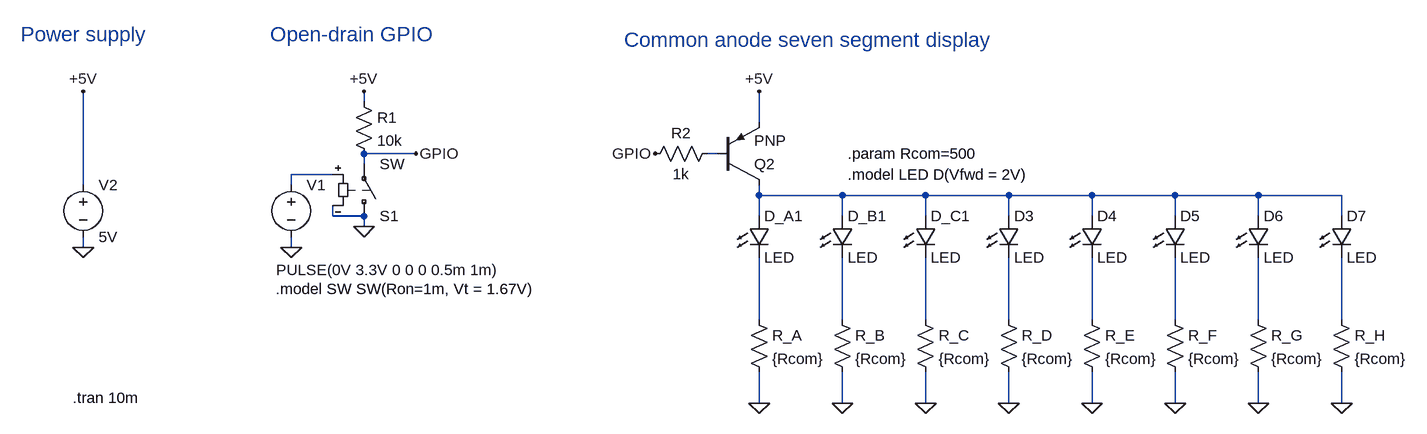
[diagram p0: schematic display_control_pnp.asc]
display_control_pnp.asc, the LTspice schematic file:
Version 4
SHEET 1 1380 680
WIRE -240 48 -240 32
WIRE 368 80 368 32
WIRE -160 128 -240 128
WIRE 304 128 288 128
WIRE -240 144 -240 128
WIRE -288 160 -352 160
WIRE -672 176 -672 32
WIRE -352 176 -352 160
WIRE 368 192 368 176
WIRE 496 192 368 192
WIRE 624 192 496 192
WIRE 752 192 624 192
WIRE 880 192 752 192
WIRE 1008 192 880 192
WIRE 1136 192 1008 192
WIRE 1264 192 1136 192
WIRE -288 224 -288 208
WIRE -240 224 -288 224
WIRE 368 224 368 192
WIRE 496 224 496 192
WIRE 624 224 624 192
WIRE 752 224 752 192
WIRE 880 224 880 192
WIRE 1008 224 1008 192
WIRE 1136 224 1136 192
WIRE 1264 224 1264 192
WIRE -240 240 -240 224
WIRE -672 272 -672 256
WIRE -352 272 -352 256
WIRE 368 384 368 288
WIRE 496 384 496 288
WIRE 624 384 624 288
WIRE 752 384 752 288
WIRE 880 384 880 288
WIRE 1008 384 1008 288
WIRE 1136 384 1136 288
WIRE 1264 384 1264 288
WIRE 368 512 368 464
WIRE 496 512 496 464
WIRE 624 512 624 464
WIRE 752 512 752 464
WIRE 880 512 880 464
WIRE 1008 512 1008 464
WIRE 1136 512 1136 464
WIRE 1264 512 1264 464
FLAG 368 512 0
FLAG 368 32 +5V
FLAG -352 272 0
FLAG -672 272 0
FLAG -672 32 +5V
FLAG 752 512 0
FLAG 880 512 0
FLAG 1008 512 0
FLAG 1136 512 0
FLAG 1264 512 0
FLAG 496 512 0
FLAG 624 512 0
FLAG -240 240 0
FLAG -160 128 GPIO
FLAG -240 32 +5V
FLAG 208 128 GPIO
SYMBOL res 352 368 R0
SYMATTR InstName R_A
SYMATTR Value {Rcom}
SYMBOL res 304 112 R90
WINDOW 0 0 56 VBottom 2
WINDOW 3 32 56 VTop 2
SYMATTR InstName R2
SYMATTR Value 1k
SYMBOL voltage -352 160 R0
WINDOW 3 -23 147 Left 2
WINDOW 123 0 0 Left 0
WINDOW 39 0 0 Left 0
SYMATTR Value PULSE(0V 3.3V 0 0 0 0.5m 1m)
SYMATTR InstName V1
SYMBOL voltage -672 160 R0
WINDOW 123 0 0 Left 0
WINDOW 39 0 0 Left 0
SYMATTR InstName V2
SYMATTR Value 5V
SYMBOL LED 352 224 R0
SYMATTR InstName D_A1
SYMATTR Value LED
SYMBOL pnp 304 176 M180
SYMATTR InstName Q2
SYMBOL LED 480 224 R0
SYMATTR InstName D_B1
SYMATTR Value LED
SYMBOL LED 608 224 R0
SYMATTR InstName D_C1
SYMATTR Value LED
SYMBOL LED 736 224 R0
SYMATTR InstName D3
SYMATTR Value LED
SYMBOL LED 864 224 R0
SYMATTR InstName D4
SYMATTR Value LED
SYMBOL LED 992 224 R0
SYMATTR InstName D5
SYMATTR Value LED
SYMBOL LED 1120 224 R0
SYMATTR InstName D6
SYMATTR Value LED
SYMBOL LED 1248 224 R0
SYMATTR InstName D7
SYMATTR Value LED
SYMBOL res 480 368 R0
SYMATTR InstName R_B
SYMATTR Value {Rcom}
SYMBOL res 608 368 R0
SYMATTR InstName R_C
SYMATTR Value {Rcom}
SYMBOL res 736 368 R0
SYMATTR InstName R_D
SYMATTR Value {Rcom}
SYMBOL res 864 368 R0
SYMATTR InstName R_E
SYMATTR Value {Rcom}
SYMBOL res 992 368 R0
SYMATTR InstName R_F
SYMATTR Value {Rcom}
SYMBOL res 1120 368 R0
SYMATTR InstName R_G
SYMATTR Value {Rcom}
SYMBOL res 1248 368 R0
SYMATTR InstName R_H
SYMATTR Value {Rcom}
SYMBOL res -256 32 R0
SYMATTR InstName R1
SYMATTR Value 10k
SYMBOL sw -240 240 M180
SYMATTR InstName S1
TEXT -688 504 Left 2 !.tran 10m
TEXT 504 160 Left 2 !.model LED D(Vfwd = 2V)
TEXT 504 128 Left 2 !.param Rcom=500
TEXT -376 336 Left 2 !.model SW SW(Ron=1m, Vt = 1.67V)
TEXT -768 -56 Left 3 ;Power supply
TEXT -384 -56 Left 3 ;Open-drain GPIO
TEXT 160 -48 Left 3 ;Common anode seven segment display

The netlist it stands for:
* display_control_pnp.asc
R_A N004 0 {Rcom}
R2 N001 GPIO 1k
V1 N002 0 PULSE(0V 3.3V 0 0 0 0.5m 1m)
V2 +5V 0 5V
D_A1 N003 N004 LED
Q2 N003 N001 +5V 0 PNP
D_B1 N003 N005 LED
D_C1 N003 N006 LED
D3 N003 N007 LED
D4 N003 N008 LED
D5 N003 N009 LED
D6 N003 N010 LED
D7 N003 N011 LED
R_B N005 0 {Rcom}
R_C N006 0 {Rcom}
R_D N007 0 {Rcom}
R_E N008 0 {Rcom}
R_F N009 0 {Rcom}
R_G N010 0 {Rcom}
R_H N011 0 {Rcom}
R1 +5V GPIO 10k
S1 0 GPIO N002 0 SW
.model D D
.lib standard.dio
.model NPN NPN
.model PNP PNP
.lib standard.bjt
.tran 10m
.model LED D(Vfwd = 2V)
.param Rcom=500
.model SW SW(Ron=1m, Vt = 1.67V)
* Power supply
* Open-drain GPIO
* Common anode seven segment display
.backanno
.end